# Altium schematic sheet fuelCell_page1.SchDoc
size A4; DrawnBy: Nicholas Semmens; SheetNumber: 1; SheetTotal: 2
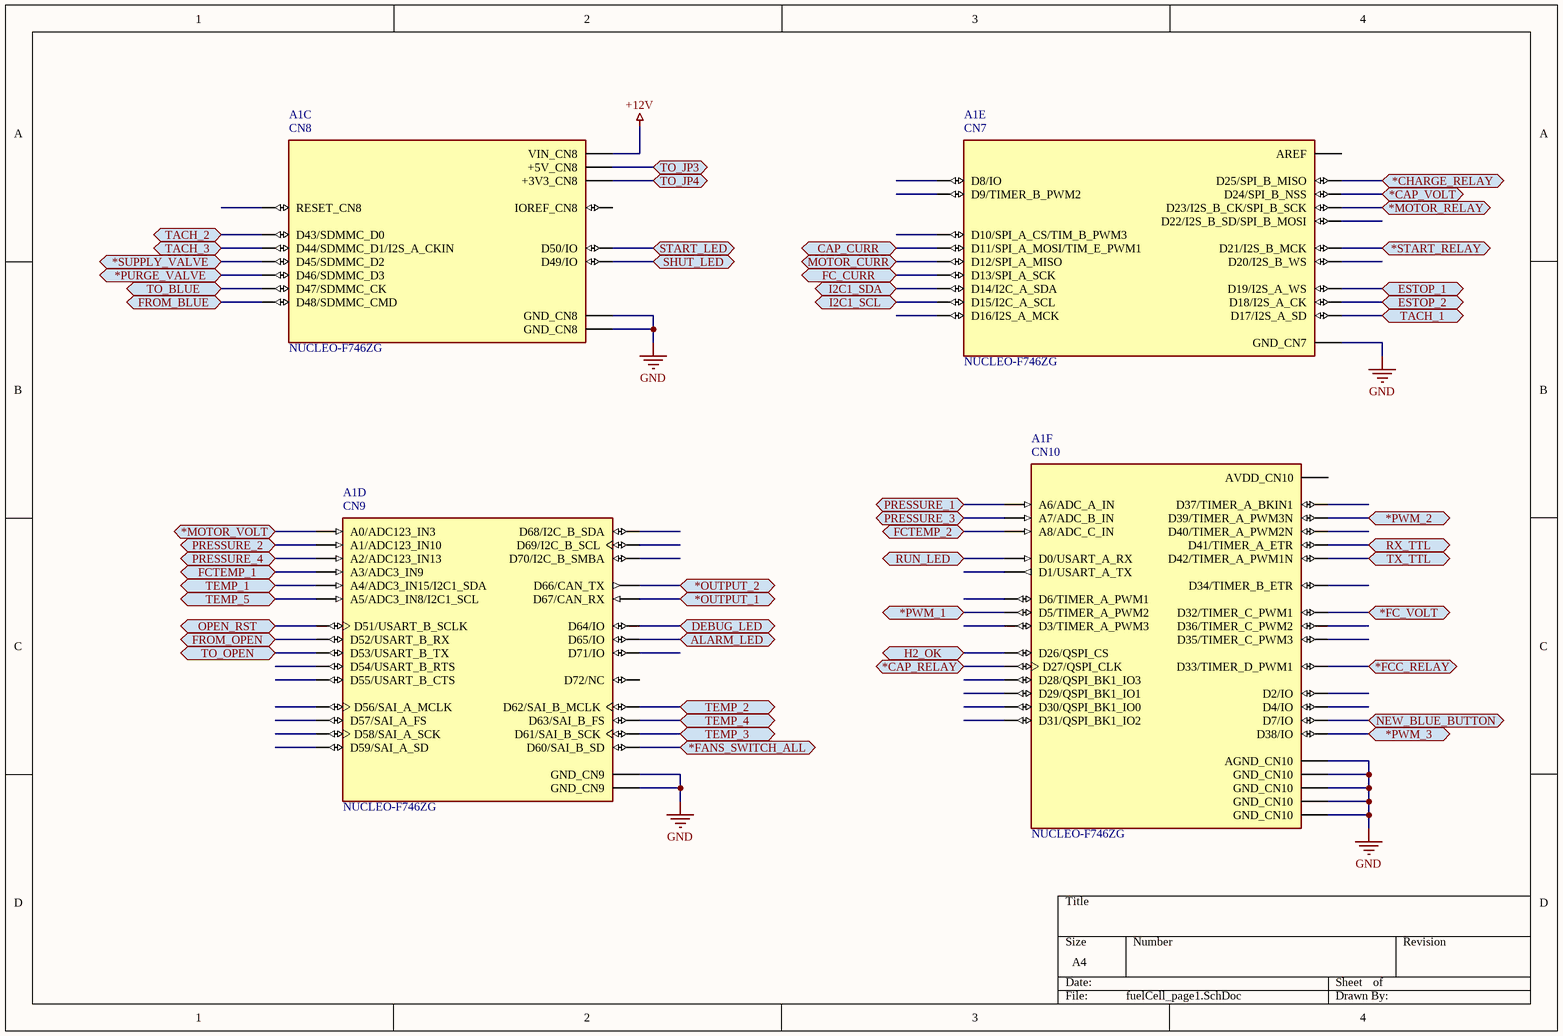
[diagram p0: fuelCell_page1.SchDoc]

## Parts
A1  NUCLEO-F746ZG  [MODULE_NUCLEO-F746ZG]  (parts C,D,E,F of 6)

## Ports
*CAP_RELAY (bidir), *CAP_VOLT (bidir), *CHARGE_RELAY (bidir), *FANS_SWITCH_ALL (bidir), *FC_VOLT (bidir), *FCC_RELAY (bidir), *MOTOR_RELAY (bidir), *MOTOR_VOLT (bidir), *OUTPUT_1 (bidir), *OUTPUT_2 (bidir), *PURGE_VALVE (bidir), *PWM_1 (bidir), *PWM_2 (bidir), *PWM_3 (bidir), *START_RELAY (bidir), *SUPPLY_VALVE (bidir), ALARM_LED (bidir), CAP_CURR (bidir), DEBUG_LED (bidir), ESTOP_1 (bidir), ESTOP_2 (bidir), FC_CURR (bidir), FCTEMP_1 (bidir), FCTEMP_2 (bidir), FROM_BLUE (bidir), FROM_OPEN (bidir), H2_OK (bidir), I2C1_SCL (bidir), I2C1_SDA (bidir), MOTOR_CURR (bidir), NEW_BLUE_BUTTON (bidir), OPEN_RST (bidir), PRESSURE_1 (bidir), PRESSURE_2 (bidir), PRESSURE_3 (bidir), PRESSURE_4 (bidir), RUN_LED (bidir), RX_TTL (bidir), SHUT_LED (bidir), START_LED (bidir), TACH_1 (bidir), TACH_2 (bidir), TACH_3 (bidir), TEMP_1 (bidir), TEMP_2 (bidir), TEMP_3 (bidir), TEMP_4 (bidir), TEMP_5 (bidir), TO_BLUE (bidir), TO_JP3 (bidir), TO_JP4 (bidir), TO_OPEN (bidir), TX_TTL (bidir)

## Nets
+12V: A1.CN8_15(VIN_CN8)
GND: A1.CN7_8(GND_CN7) A1.CN8_11(GND_CN8) A1.CN8_13(GND_CN8) A1.CN9_12(GND_CN9) A1.CN9_23(GND_CN9) A1.CN10_3(AGND_CN10) A1.CN10_5(GND_CN10) A1.CN10_17(GND_CN10) A1.CN10_22(GND_CN10) A1.CN10_27(GND_CN10)
*CAP_RELAY: A1.CN10_15(D27/QSPI_CLK) ; port *CAP_RELAY
*CAP_VOLT: A1.CN7_17(D24/SPI_B_NSS) ; port *CAP_VOLT
*CHARGE_RELAY: A1.CN7_19(D25/SPI_B_MISO) ; port *CHARGE_RELAY
*FANS_SWITCH_ALL: A1.CN9_22(D60/SAI_B_SD) ; port *FANS_SWITCH_ALL
*FC_VOLT: A1.CN10_29(D32/TIMER_C_PWM1) ; port *FC_VOLT
*FCC_RELAY: A1.CN10_31(D33/TIMER_D_PWM1) ; port *FCC_RELAY
*MOTOR_RELAY: A1.CN7_15(D23/I2S_B_CK/SPI_B_SCK) ; port *MOTOR_RELAY
*MOTOR_VOLT: A1.CN9_1(A0/ADC123_IN3) ; port *MOTOR_VOLT
*OUTPUT_1: A1.CN9_25(D67/CAN_RX) ; port *OUTPUT_1
*OUTPUT_2: A1.CN9_27(D66/CAN_TX) ; port *OUTPUT_2
*PURGE_VALVE: A1.CN8_8(D46/SDMMC_D3) ; port *PURGE_VALVE
*PWM_1: A1.CN10_6(D5/TIMER_A_PWM2) ; port *PWM_1
*PWM_2: A1.CN10_26(D39/TIMER_A_PWM3N) ; port *PWM_2
*PWM_3: A1.CN10_28(D38/IO) ; port *PWM_3
*START_RELAY: A1.CN7_11(D21/I2S_B_MCK) ; port *START_RELAY
*SUPPLY_VALVE: A1.CN8_6(D45/SDMMC_D2) ; port *SUPPLY_VALVE
ALARM_LED: A1.CN9_29(D65/IO) ; port ALARM_LED
CAP_CURR: A1.CN7_14(D11/SPI_A_MOSI/TIM_E_PWM1) ; port CAP_CURR
DEBUG_LED: A1.CN9_30(D64/IO) ; port DEBUG_LED
ESTOP_1: A1.CN7_7(D19/I2S_A_WS) ; port ESTOP_1
ESTOP_2: A1.CN7_5(D18/I2S_A_CK) ; port ESTOP_2
FC_CURR: A1.CN7_10(D13/SPI_A_SCK) ; port FC_CURR
FCTEMP_1: A1.CN9_7(A3/ADC3_IN9) ; port FCTEMP_1
FCTEMP_2: A1.CN10_11(A8/ADC_C_IN) ; port FCTEMP_2
FROM_BLUE: A1.CN8_12(D48/SDMMC_CMD) ; port FROM_BLUE
FROM_OPEN: A1.CN9_4(D52/USART_B_RX) ; port FROM_OPEN
H2_OK: A1.CN10_13(D26/QSPI_CS) ; port H2_OK
I2C1_SCL: A1.CN7_2(D15/I2C_A_SCL) ; port I2C1_SCL
I2C1_SDA: A1.CN7_4(D14/I2C_A_SDA) ; port I2C1_SDA
MOTOR_CURR: A1.CN7_12(D12/SPI_A_MISO) ; port MOTOR_CURR
NEW_BLUE_BUTTON: A1.CN10_2(D7/IO) ; port NEW_BLUE_BUTTON
OPEN_RST: A1.CN9_2(D51/USART_B_SCLK) ; port OPEN_RST
PRESSURE_1: A1.CN10_7(A6/ADC_A_IN) ; port PRESSURE_1
PRESSURE_2: A1.CN9_3(A1/ADC123_IN10) ; port PRESSURE_2
PRESSURE_3: A1.CN10_9(A7/ADC_B_IN) ; port PRESSURE_3
PRESSURE_4: A1.CN9_5(A2/ADC123_IN13) ; port PRESSURE_4
RUN_LED: A1.CN10_16(D0/USART_A_RX) ; port RUN_LED
RX_TTL: A1.CN10_20(D41/TIMER_A_ETR) ; port RX_TTL
SHUT_LED: A1.CN8_14(D49/IO) ; port SHUT_LED
START_LED: A1.CN8_16(D50/IO) ; port START_LED
TACH_1: A1.CN7_3(D17/I2S_A_SD) ; port TACH_1
TACH_2: A1.CN8_2(D43/SDMMC_D0) ; port TACH_2
TACH_3: A1.CN8_4(D44/SDMMC_D1/I2S_A_CKIN) ; port TACH_3
TEMP_1: A1.CN9_9(A4/ADC3_IN15/I2C1_SDA) ; port TEMP_1
TEMP_2: A1.CN9_26(D62/SAI_B_MCLK) ; port TEMP_2
TEMP_3: A1.CN9_24(D61/SAI_B_SCK) ; port TEMP_3
TEMP_4: A1.CN9_28(D63/SAI_B_FS) ; port TEMP_4
TEMP_5: A1.CN9_11(A5/ADC3_IN8/I2C1_SCL) ; port TEMP_5
TO_BLUE: A1.CN8_10(D47/SDMMC_CK) ; port TO_BLUE
TO_JP3: A1.CN8_9(+5V_CN8) ; port TO_JP3
TO_JP4: A1.CN8_7(+3V3_CN8) ; port TO_JP4
TO_OPEN: A1.CN9_6(D53/USART_B_TX) ; port TO_OPEN
TX_TTL: A1.CN10_18(D42/TIMER_A_PWM1N) ; port TX_TTL

Not connected (* = marked no-connect by the designer): A1 CN7_1(D16/I2S_A_MCK) CN7_6(AREF) CN7_9(D20/I2S_B_WS) CN7_13(D22/I2S_B_SD/SPI_B_MOSI) CN7_16(D10/SPI_A_CS/TIM_B_PWM3) CN7_18(D9/TIMER_B_PWM2) CN7_20(D8/IO) CN8_3(IOREF_CN8) CN8_5(RESET_CN8) CN9_8(D54/USART_B_RTS) CN9_10(D55/USART_B_CTS) CN9_13(D72/NC) CN9_14(D56/SAI_A_MCLK) CN9_15(D71/IO) CN9_16(D57/SAI_A_FS) CN9_17(D70/I2C_B_SMBA) CN9_18(D58/SAI_A_SCK) CN9_19(D69/I2C_B_SCL) CN9_20(D59/SAI_A_SD) CN9_21(D68/I2C_B_SDA) CN10_1(AVDD_CN10) CN10_4(D6/TIMER_A_PWM1) CN10_8(D4/IO) CN10_10(D3/TIMER_A_PWM3) CN10_12(D2/IO) CN10_14(D1/USART_A_TX) CN10_19(D28/QSPI_BK1_IO3) CN10_21(D29/QSPI_BK1_IO1) CN10_23(D30/QSPI_BK1_IO0) CN10_24(D40/TIMER_A_PWM2N) CN10_25(D31/QSPI_BK1_IO2) CN10_30(D37/TIMER_A_BKIN1) CN10_32(D36/TIMER_C_PWM2) CN10_33(D34/TIMER_B_ETR) CN10_34(D35/TIMER_C_PWM3)

## Notes on the sheet
- (in symbol NUCLEO-F746ZG, part C) CN8
- (in symbol NUCLEO-F746ZG, part D) CN9
- (in symbol NUCLEO-F746ZG, part E) CN7
- (in symbol NUCLEO-F746ZG, part F) CN10

## Library data of the parts
A1 = NUCLEO-F746ZG: STM32F746ZG, mbed-Enabled Development Nucleo-144 STM32F7 ARMÂ® CortexÂ®-M7 MCU 32-Bit Embedded Evaluation Board; MF: STMicroelectronics; SnapEDA_Link: https://www.snapeda.com/parts/NUCLEO-F746ZG/STMicroelectronics/view-part/531935/?ref=snap; Price: None; Check_prices: https://www.snapeda.com/parts/NUCLEO-F746ZG/STMicroelectronics/view-part/531935/?ref=eda; Value: *; Package: None; Availability: Warning; Purchase-URL: https://pricing.snapeda.com/search/part/NUCLEO-F746ZG/?ref=eda; MP: NUCLEO-F746ZG